# EAGLE design untitled (EAGLE 9.5.2)
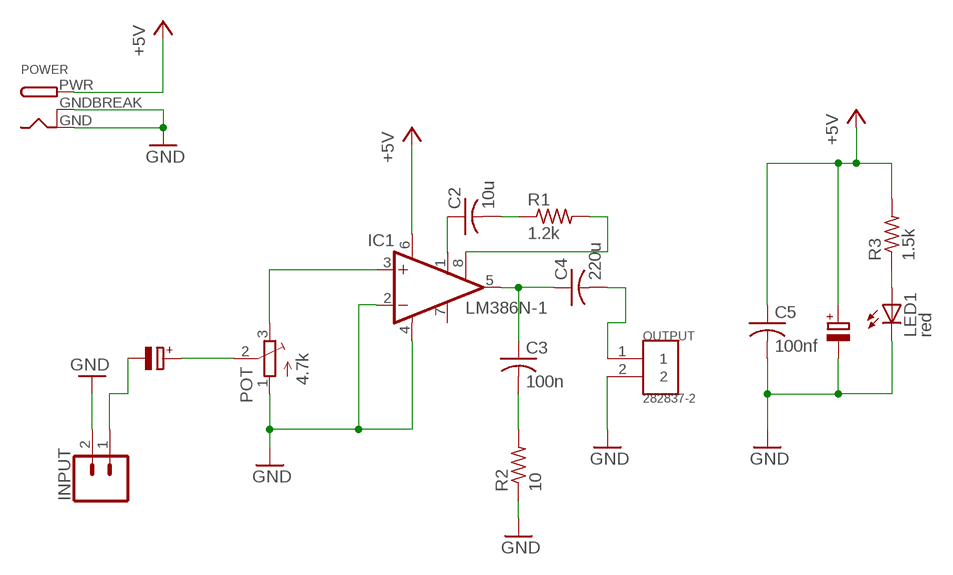
[diagram p0: schematic, sheet 1]

## Parts
C2  10u  C-US025-040X050  [C025-040X050]
C3  100n  C-US025-040X050  [C025-040X050]
C4  220u  C-US025-040X050  [C025-040X050]
C5  100nf  C-US025-040X050  [C025-040X050]
IC1  LM386N-1  [DIL08]
INPUT  CONN_02  [1X02]
LED1  red  LED3MM  [LED3MM]
OUTPUT  282837-2  [TE_282837-2]
POT  4.7k  TRIMPOT3386  [TRIM-3386]
POWER  DCBARRELPTH  [DCJACK_2MM_PTH]
R1  1.2k  R-US_0204/5  [0204/5]
R2  10  R-US_0204/5  [0204/5]
R3  1.5k  R-US_0204/5  [0204/5]

## Nets
+5V: C5.1 IC1.6(VS) POWER.PWR R3.2
GND: C5.2 IC1.2(-IN) IC1.4(GND) INPUT.2 LED1.K(C) OUTPUT.2 POT.1(A) POWER.GND POWER.GNDBREAK R2.1
N$1: C3.2 R2.2
N$2: C4.2 OUTPUT.1
N$3: C2.2 R1.1
N$4: POT.2(S)
N$5: IC1.3(+IN) POT.3(E)
N$6: IC1.8(GAIN) R1.2
N$7: INPUT.1
N$8: C2.1 IC1.1(GAIN)
N$10: C3.1 C4.1 IC1.5(OUT)
N$11: LED1.A R3.1
Unconnected: IC1.7(BYPASS)

## Library data of the parts
C2-C5 = adafruit:C-US: CAPACITOR, American symbol
IC1 = linear:LM386?-*: Low Voltage Audio Power Amplifier Source: http://cache.national.com/ds/LM/LM386.pdf
INPUT = SparkFun-Connectors:CONN_02: Multi connection point. Often used as Generic Header-pin footprint for 0.1 inch spaced/style header connections On any of the 0.1 inch spaced packages, you can populate with these: Break Away Headers - Straight <https://www.sparkfun.com/products/116> (PRT-00116) Break Away Male Headers - Right Angle <https://www.sparkfun.com/products/553> (PRT-00553) Female Headers <https://www.sparkfun.com/products/115> (PRT-00115) Break Away Headers - Machine Pin <https://www.sparkfun.com/products/117> (PRT-00117) Break Away Female Headers - Swiss Machine Pin <https://www.sparkfun.com/products/743> (PRT-00743) For SCREWTERMINALS and SPRING TERMINALS visit here: Screw Terimnals on SparkFun.com <https://www.sparkfun.com/search/results?term=Screw+Terminals> (5mm/3.5mm/2.54mm spacing) This device is also useful as a general connection point to wire up your design to another part of your project. Our various solder wires solder well into these plated through hole pads. Hook-Up Wire - Assortment (Stranded, 22 AWG) <https://www.sparkfun.com/products/11375> (PRT-11375) Hook-Up Wire - Assortment (Solid Core, 22 AWG) <https://www.sparkfun.com/products/11367> (PRT-11367) View the entire wire category on our website here <https://www.sparkfun.com/categories/141> Special notes: Molex polarized connector foot print use with: PRT-08233 with associated crimp pins and housings. 2.54_SCREWTERM for use with PRT-10571. 3.5mm Screw Terminal footprints for PRT-08084 5mm Screw Terminal footprints for use with PRT-08432
LED1 = adafruit:LED: LED OSRAM: - CHIPLED LG R971, LG N971, LY N971, LG Q971, LY Q971, LO R971, LY R971 LH N974, LH R974 LS Q976, LO Q976, LY Q976 LO Q996 - Hyper CHIPLED LW Q18S LB Q993, LB Q99A, LB R99A - SideLED LS A670, LO A670, LY A670, LG A670, LP A670 LB A673, LV A673, LT A673, LW A673 LH A674 LY A675 LS A676, LA A676, LO A676, LY A676, LW A676 LS A679, LY A679, LG A679 - Hyper Micro SIDELED® LS Y876, LA Y876, LO Y876, LY Y876 LT Y87S - SmartLED LW L88C, LW L88S LB L89C, LB L89S, LG L890 LS L89K, LO L89K, LY L89K LS L896, LA L896, LO L896, LY L896 - TOPLED LS T670, LO T670, LY T670, LG T670, LP T670 LSG T670, LSP T670, LSY T670, LOP T670, LYG T670 LG T671, LOG T671, LSG T671 LB T673, LV T673, LT T673, LW T673 LH T674 LS T676, LA T676, LO T676, LY T676, LB T676, LH T676, LSB T676, LW T676 LB T67C, LV T67C, LT T67C, LS T67K, LO T67K, LY T67K, LW E67C LS E67B, LA E67B, LO E67B, LY E67B, LB E67C, LV E67C, LT E67C LW T67C LS T679, LY T679, LG T679 LS T770, LO T770, LY T770, LG T770, LP T770 LB T773, LV T773, LT T773, LW T773 LH T774 LS E675, LA E675, LY E675, LS T675 LS T776, LA T776, LO T776, LY T776, LB T776 LHGB T686 LT T68C, LB T68C - Hyper Mini TOPLED® LB M676 - Mini TOPLED Santana® LG M470 LS M47K, LO M47K, LY M47K Source: http://www.osram.convergy.de/
OUTPUT = Screw Terminal connector 2:282837-2: TERM BLOCK 5.08MM 2POS SIDE ENTY Check prices <https://pricing.snapeda.com/parts/282837-2/TE%20Connectivity/view-part?ref=eda>; AVAILABILITY: Good; COMMENT: 282837-2; DESCRIPTION: Connector Terminal Blocks Receptacle 2 Position 5.08mm Solder Straight Thru-Hole 13.5A/Contact; MF: TE Connectivity; MP: 282837-2; PACKAGE: None; PRICE: None; PURCHASE-URL: https://pricing.snapeda.com/search/part/282837-2/?ref=eda
POT = adafruit:TRIMPOT: SMT trimmer potentiometer part number TC33X http://www.ladyada.net/library/eagle
POWER = adafruit:DCBARREL: 2.0mm DC Barrel Jack DCJACK_2MM_PTH - Through Hole Jack (4UConnector: 05537)
R1-R3 = adafruit:R-US_: RESISTOR, American symbol

## Board
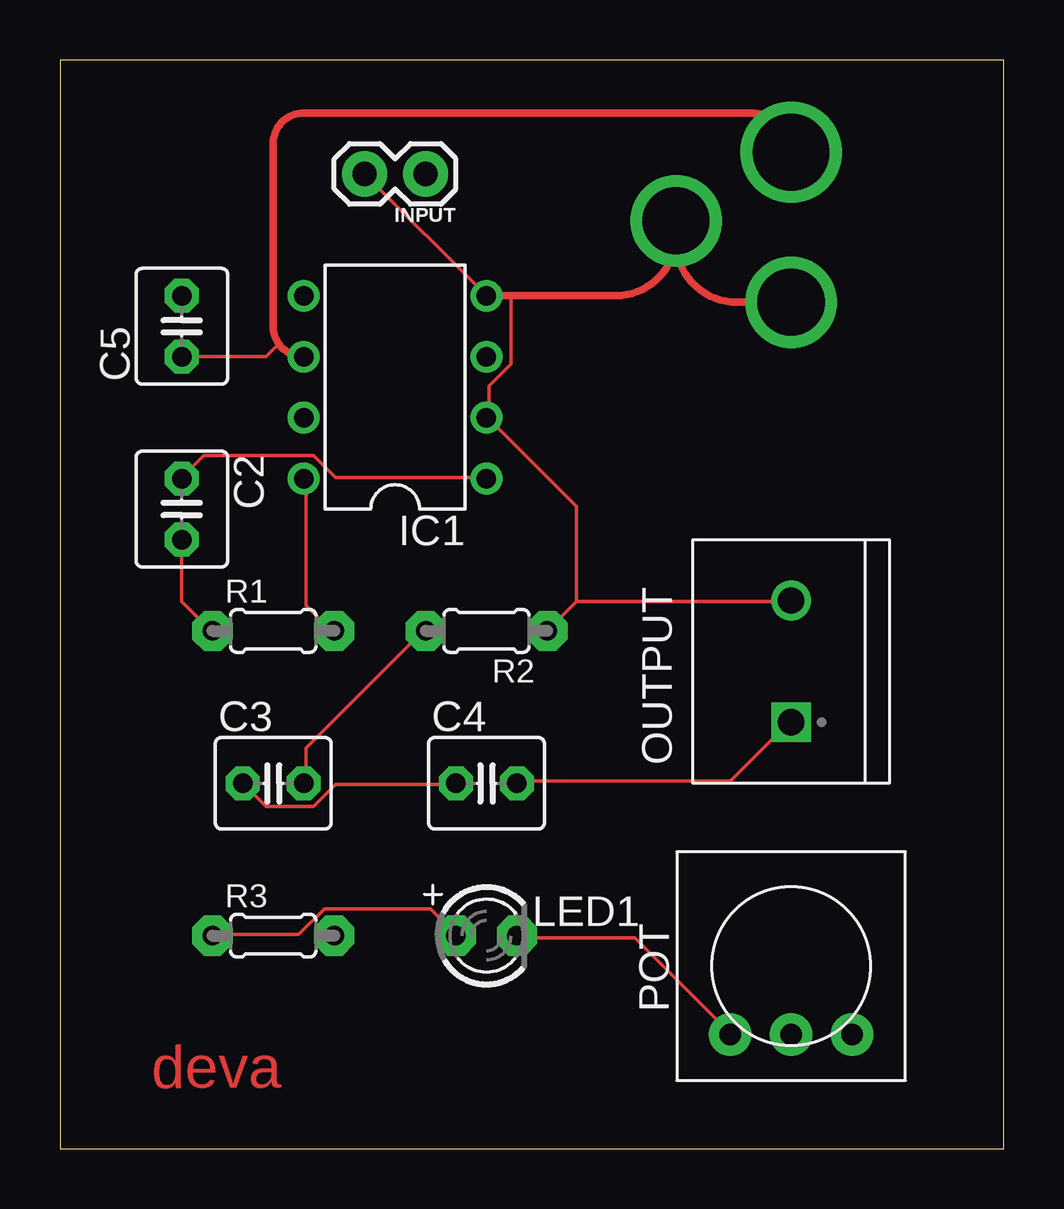
[diagram p1: board, top side]
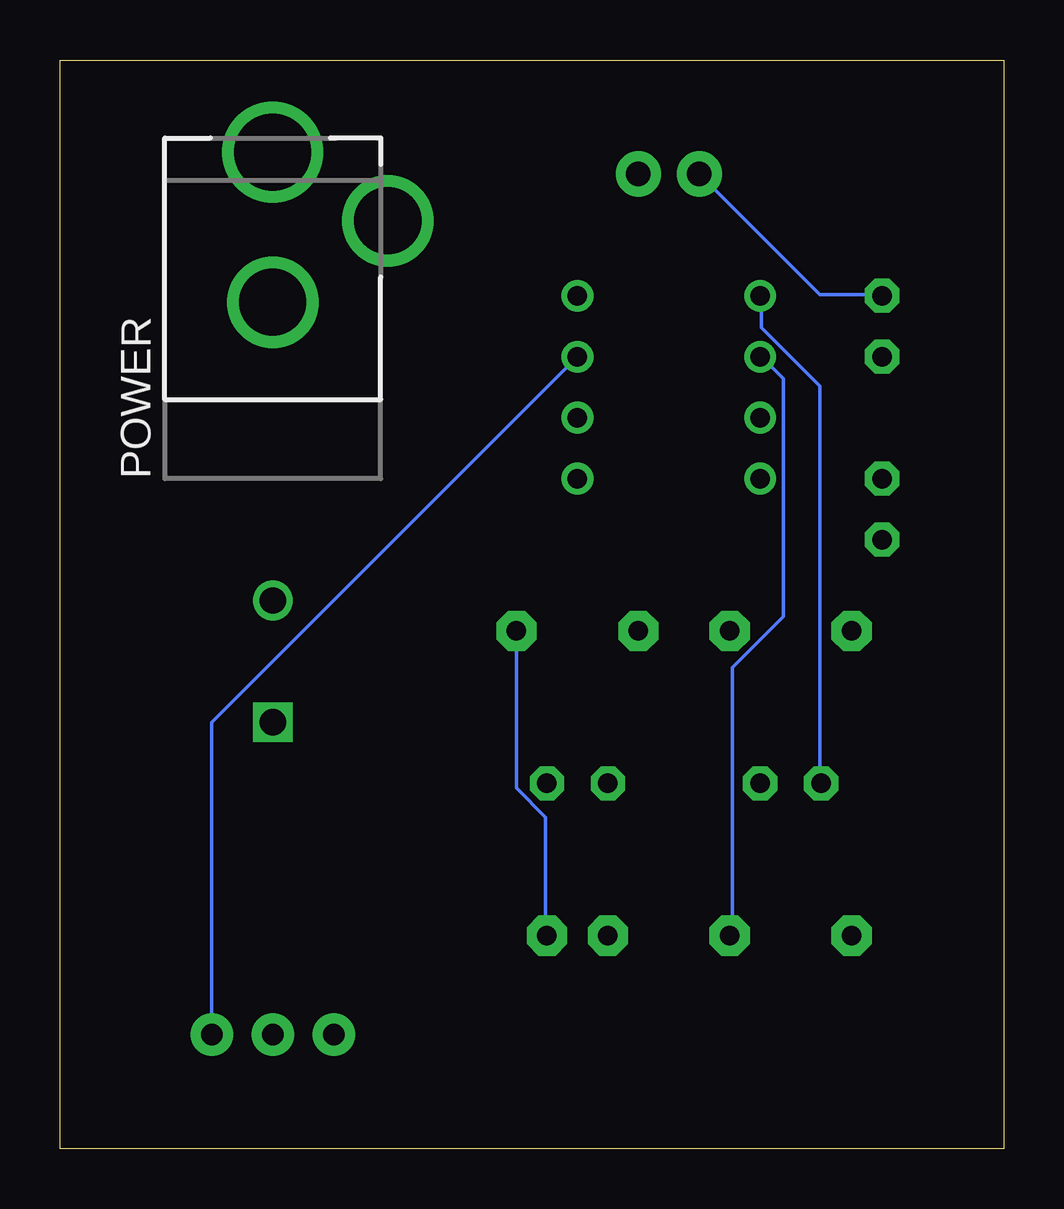
[diagram p2: board, bottom side, seen from below]

Size 39.35 x 45.39 mm. Coordinates in mm from the lower left corner, seen from the top.
Outline: 0,0 39.35,0 39.35,45.39 0,45.39 0,0
Copper layers (1*16): Top 0.035mm / dielectric 1.5mm / Bottom 0.035mm
Design rules "default": minimum track width 6mil, minimum drill 0.35mm, track to track 6mil, track to pad 6mil, pad to pad 6mil, via to via 6mil, smd to smd 6mil, copper to edge 40mil, drill to drill 6mil, minimum pad ring 10mil, minimum via ring 8mil, stop-mask expansion 4mil, vias tented up to drill 0mil, thermal gap 10mil

### Footprints (pad centres in the part's own frame; a part is rotated, then mirrored left to right if it is on the bottom)
C025-040X050 = drill 0.813 pad 1.422 octagon: 1 -1.27,0; 2 1.27,0
DIL08 = drill 0.813 pad 1.27: 1 -3.81,-3.81; 2 -1.27,-3.81; 3 1.27,-3.81; 4 3.81,-3.81; 5 3.81,3.81; 6 1.27,3.81; 7 -1.27,3.81; 8 -3.81,3.81
1X02 = drill 1.016 pad 1.88: 1 0,0; 2 2.54,0
LED3MM = drill 0.813 pad 1.676 octagon: A -1.27,0; K 1.27,0
TE_282837-2 = drill 1.1 square: 1 -2.54,0 | drill 1.1: 2 2.54,0
TRIM-3386 = drill 0.9 pad 1.778: 1 -2.54,-2.857; 2 0,-2.857; 3 2.54,-2.857
DCJACK_2MM_PTH = drill 2.8: GND 0,7.35; GNDBREAK 4.8,10.75 | drill 3.2: PWR 0,13.6
0204/5 = drill 0.813 pad 1.676 octagon: 1 -2.54,0; 2 2.54,0

### Placement (x,y rotation side)
C2  5.08,26.67 270 top
C3  8.89,15.24 0 top
C4  17.78,15.24 0 top
C5  5.08,34.29 90 top
IC1  13.97,31.75 90 top
INPUT  15.24,40.64 180 top
LED1  17.78,8.89 0 top
OUTPUT  30.48,20.32 90 top
POT  30.48,7.62 0 top
POWER  30.48,27.94 0 bottom
R1  8.89,21.59 0 top
R2  17.78,21.59 180 top
R3  8.89,8.89 0 top

### Tracks (layer width: path | path; a pad name or v marks a point on that pad's centre or on a via)
+5V
  Top 0.152: C5.1 8.58,33.02 9.04,33.48 9.13,33.54
  Top 0.305: POWER.PWR arc90 28.84,43.18 10.16,43.18 arc90 8.89,41.91 8.89,34.29 arc36 9.13,33.54 arc54 IC1.6
  Bottom 0.152: R3.2 11.33,8.94 11.33,20.07 9.19,22.2 9.19,32.11 10.11,33.02 IC1.6
GND
  Top 0.152: LED1.K 19.1,8.79 23.98,8.79 27.94,4.83 POT.1 | 21.54,22.81 30.38,22.81 OUTPUT.2 | R2.1 21.54,22.81 | 18.8,35.56 18.8,32.72 17.88,31.8 17.88,30.58 IC1.2 17.88,30.43 21.54,26.77 21.54,22.81 | INPUT.2 IC1.4
  Top 0.305: POWER.GND 28.22,35.29 arc-90 25.68,37.83 POWER.GNDBREAK 25.68,38.1 arc-90 23.14,35.56 18.8,35.56 IC1.4
  Bottom 0.152: INPUT.2 7.67,35.61 5.08,35.61 C5.2 | R2.1 20.32,15.04 19.1,13.82 19.1,8.94 LED1.K
N$1
  Top 0.152: C3.2 10.26,15.34 10.26,16.71 15.14,21.59 R2.2
N$2
  Top 0.152: C4.2 19.1,15.34 27.94,15.34 30.38,17.78 OUTPUT.1
N$3
  Top 0.152: C2.2 5.08,22.81 6.3,21.59 R1.1
N$5
  Bottom 0.152: IC1.3 33.02,17.78 POT.3
N$6
  Top 0.152: IC1.8 10.26,27.84 10.26,22.66 11.33,21.59 R1.2
N$8
  Top 0.152: IC1.1 17.73,27.99 11.48,27.99 10.57,28.9 5.99,28.9 5.08,27.99 C2.1
N$10
  Top 0.152: C3.1 8.58,14.28 10.57,14.28 11.48,15.19 16.51,15.19 C4.1
  Bottom 0.152: IC1.5 10.11,35.46 10.11,34.24 7.67,31.8 7.67,15.34 C3.1
N$11
  Top 0.152: R3.1 6.45,8.94 9.96,8.94 11.02,10.01 15.44,10.01 16.51,8.94 LED1.A

### Text on the board
Top: deva